# Altium schematic sheet SLink Unit.SchDoc
size 203 x 152 mm; SheetNumber: 0; SheetTotal: 0
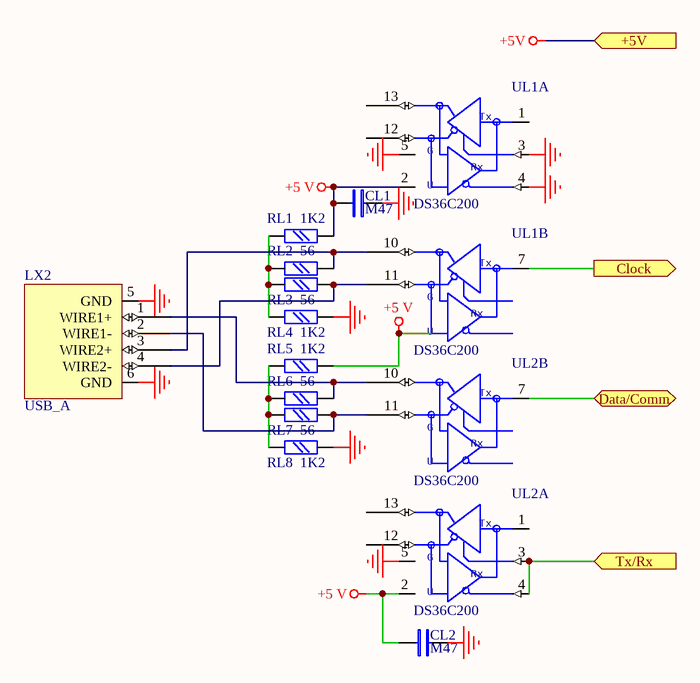
[diagram p0: SLink Unit.SchDoc]

## Parts
CL1  M47  [chip0805]
CL2  M47  [chip0805]
LX2  USB_A  [USB-A]
RL1  1K2  [chip0805]
RL2  56  [chip0805]
RL3  56  [chip0805]
RL4  1K2  [chip0805]
RL5  1K2  [chip0805]
RL6  56  [chip0805]
RL7  56  [chip0805]
RL8  1K2  [chip0805]
UL1  DS36C200  [14SO200]  (parts A,B of 2)
UL2  DS36C200  [14SO200]  (parts A,B of 2)

## Ports
+5V (in), Clock (out), Data/Comm (bidir), Tx/Rx (in)

## Nets
+5 V: CL1.1 CL2.1 RL1.2 RL5.2 UL1.2(VCC) UL2.2(VCC)
+5V: port +5V
GND: CL1.2 CL2.2 LX2.5(GND) LX2.6(GND) RL4.2 RL8.2 UL1.3(TE) UL1.4(RE) UL1.5(GND) UL2.5(GND)
Clock: UL1.7(DATA) ; port Clock
Data/Comm: UL2.7(DATA) ; port Data/Comm
Tx/Rx: UL2.3(TE) UL2.4(RE) ; port Tx/Rx
NetLX2_1: LX2.1(WIRE1+) RL6.2 UL2.10(WIRE+)
NetLX2_2: LX2.2(WIRE1-) RL7.2 UL2.11(WIRE-)
NetLX2_3: LX2.3(WIRE2+) RL2.2 UL1.10(WIRE+)
NetLX2_4: LX2.4(WIRE2-) RL3.2 UL1.11(WIRE-)
NetRL1_1: RL1.1 RL2.1 RL3.1 RL4.1
NetRL5_1: RL5.1 RL6.1 RL7.1 RL8.1

Not connected (* = marked no-connect by the designer): UL1 1(DATA) 12(WIRE-) 13(WIRE+); UL2 1(DATA) 12(WIRE-) 13(WIRE+)

## Notes on the sheet
- (in symbol DS36C200, part A) Tx; G; Rx; U
- (in symbol DS36C200, part B) Tx; G; Rx; U

## Library data of the parts
CL1 CL2 = C: Text Field1: 20; Text Field2: 10
LX2 = USB_A: Text Field1: 60; Text Field2: 70
RL1-RL8 = R: Text Field1: 20; Text Field2: 20
UL1 UL2 = DS36C200: Text Field1: 60; Text Field2: 70